# EAGLE design Senior Design Debug PCB V1 (EAGLE 6.5.0)
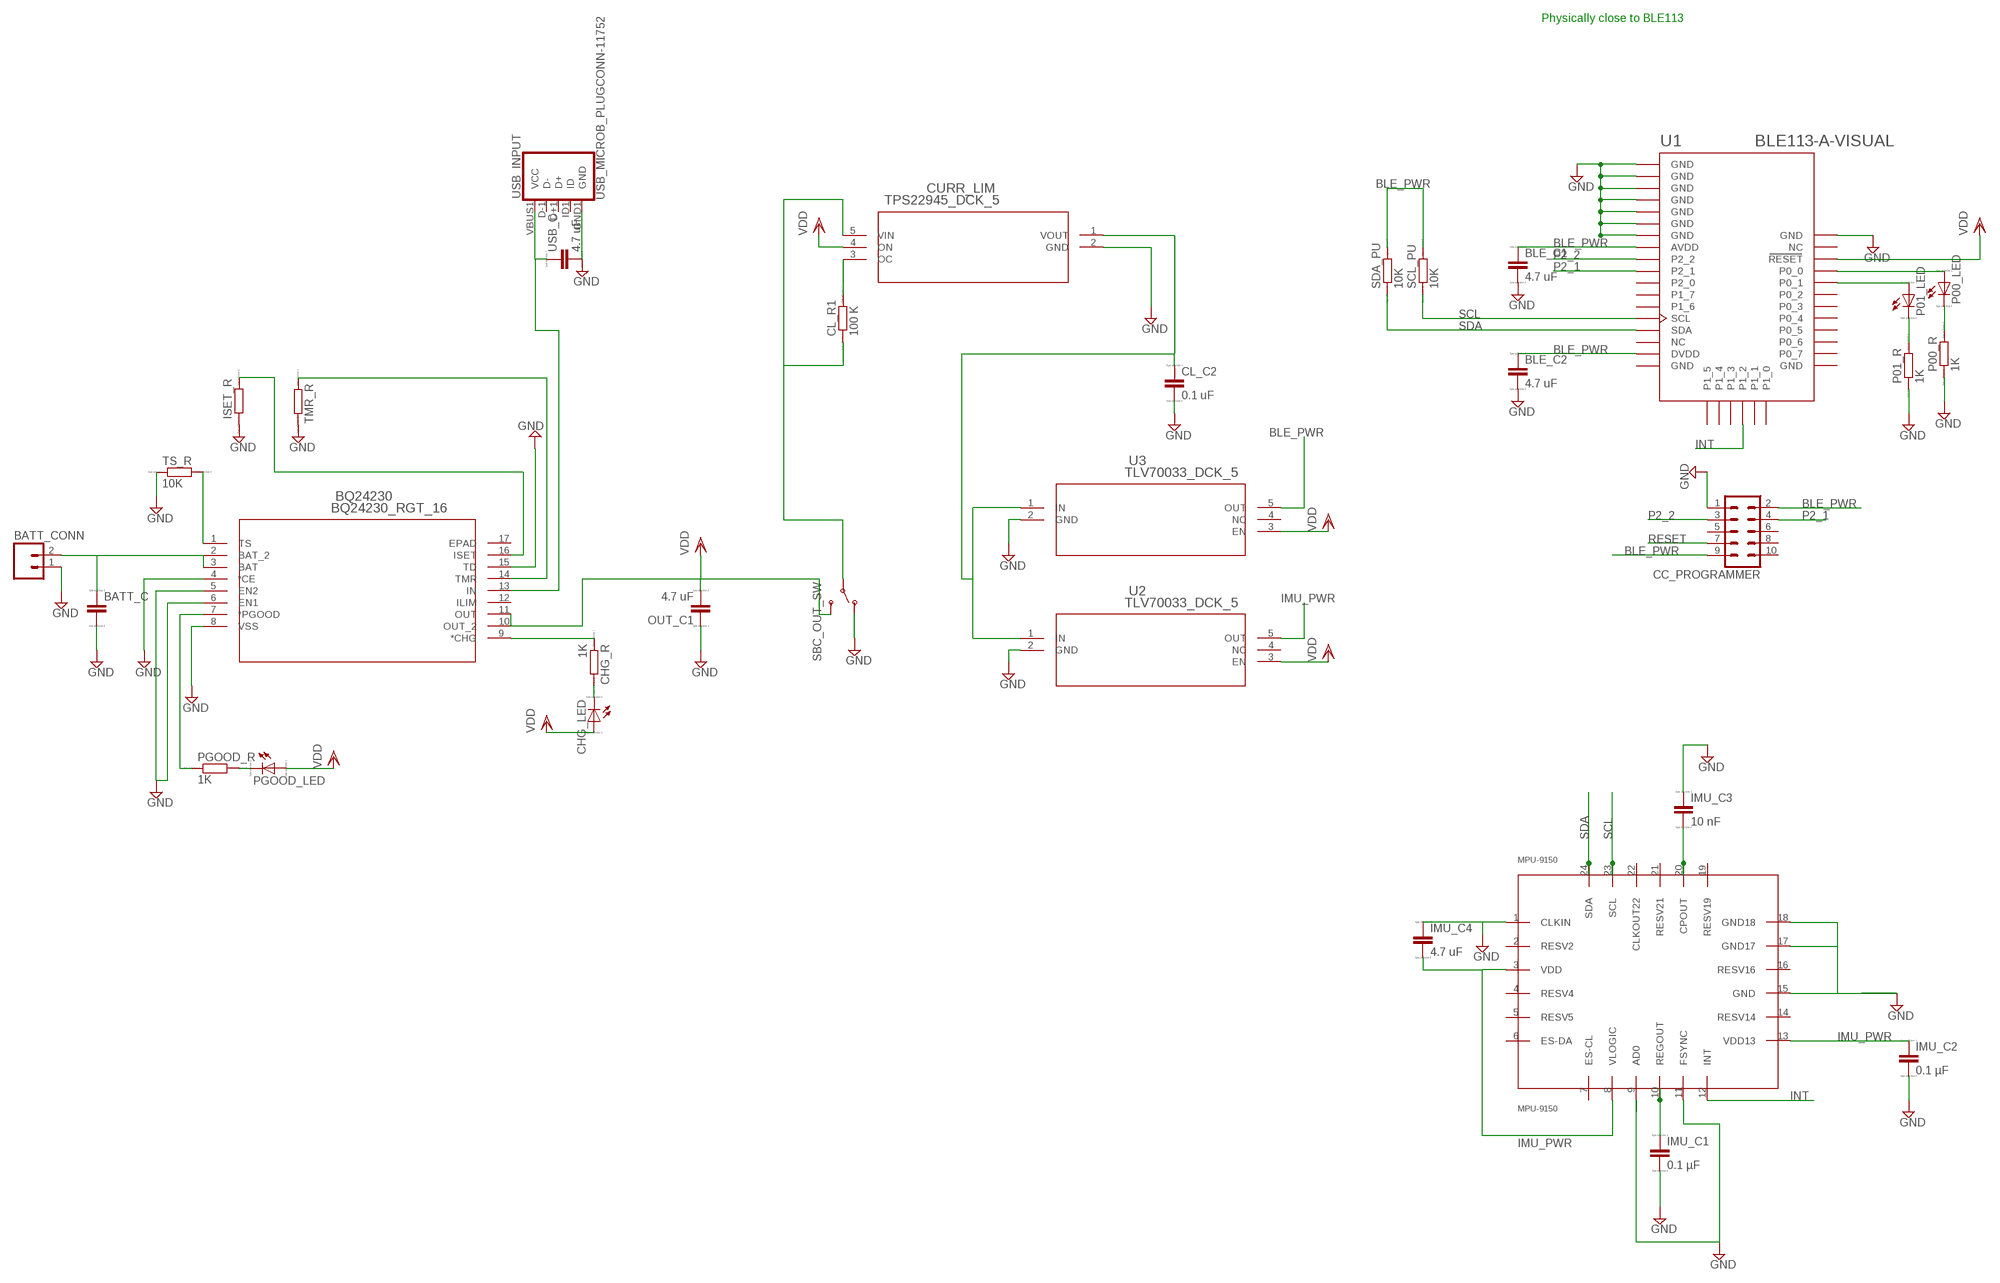
[diagram p0: schematic, sheet 1]

## Parts
BATT_C  C  [C0805]
BATT_CONN  M02  [02P]
BLE_C1  4.7 uF  C  [C0805]
BLE_C2  4.7 uF  C  [C0805]
BQ24230  BQ24230_RGT_16  [RGT16_1P7X1P7]
CC_PROGRAMMER  MA05-2  [MA05-2]
CHG_LED  LED_E  [LED_1206]
CHG_R  1K  R  [R0805]
CL_C2  0.1 uF  C  [C0805]
CL_R1  100 K  R  [R0805]
CURR_LIM  TPS22945_DCK_5  [DCK5]
IMU_C1  0.1 µF  C  [C0805]
IMU_C2  0.1 µF  C  [C0805]
IMU_C3  10 nF  C  [C0805]
IMU_C4  4.7 uF  C  [C0805]
ISET_R  R  [R0805]
MPU-9150  MPU-9150  [MPU-9150]
OUT_C1  4.7 uF  C  [C0805]
P00_LED  LED_E  [LED_1206]
P00_R  1K  R  [R0805]
P01_LED  LED_E  [LED_1206]
P01_R  1K  R  [R0805]
PGOOD_LED  LED_E  [LED_1206]
PGOOD_R  1K  R  [R0805]
SBC_OUT_SW  SWITCH-SPDTPTH  [SWITCH-SPDT]
SCL_PU  10K  R  [R0805]
SDA_PU  10K  R  [R0805]
TMR_R  R  [R0805]
TS_R  10K  R  [R0805]
U1  BLE113-A-VISUAL  [BLE113-A]
U2  TLV70033_DCK_5  [DCK5]
U3  TLV70033_DCK_5  [DCK5]
USB_C  4.7 uF  C  [C0805]
USB_INPUT  USB_MICROB_PLUGCONN-11752  [USB-B-MICRO-SMD_V03]

## Nets
BLE_PWR: BLE_C1.1 BLE_C2.1 CC_PROGRAMMER.2 CC_PROGRAMMER.9 SCL_PU.2 SDA_PU.2 U1.AVDD U1.DVDD U3.5(OUT)
DC_IN: BQ24230.13(IN) USB_C.1 USB_INPUT.VBUS1(VCC)
GND: BATT_C.2 BATT_CONN.1 BLE_C1.2 BLE_C2.2 BQ24230.4(*CE) BQ24230.5(EN2) BQ24230.6(EN1) BQ24230.8(VSS) BQ24230.15(TD) CC_PROGRAMMER.1 CL_C2.2 CURR_LIM.2(GND) IMU_C1.2 IMU_C2.2 IMU_C3.1 IMU_C4.1 ISET_R.1 MPU-9150.1(CLKIN) MPU-9150.9(AD0) MPU-9150.11(FSYNC) MPU-9150.15(GND) MPU-9150.17(GND17) MPU-9150.18(GND18) OUT_C1.1 P00_R.1 P01_R.1 SBC_OUT_SW.1(O) TMR_R.2 TS_R.1 U1.GND U1.GND@2(GND) U1.GND@3(GND) U1.GND@4(GND) U1.GND@5(GND) U1.GND@6(GND) U1.GND@7(GND) U1.GND@10(GND) U2.2(GND) U3.2(GND) USB_C.2 USB_INPUT.GND1(GND)
IMU_PWR: IMU_C2.1 IMU_C4.2 MPU-9150.3(VDD) MPU-9150.8(VLOGIC) MPU-9150.13(VDD13) U2.5(OUT)
INT: MPU-9150.12(INT) U1.P1_2
N$1: IMU_C3.2 MPU-9150.20(CPOUT)
N$2: BQ24230.16(ISET) ISET_R.2
N$3: IMU_C1.1 MPU-9150.10(REGOUT)
N$4: CHG_LED.C CHG_R.2
N$5: BQ24230.9(*CHG) CHG_R.1
N$6: PGOOD_LED.C PGOOD_R.2
N$7: P00_LED.A U1.P0_0
N$8: CL_C2.1 CURR_LIM.1(VOUT) U2.1(IN) U3.1(IN)
N$9: P01_LED.A U1.P0_1
N$13: P01_LED.C P01_R.2
N$14: P00_LED.C P00_R.2
N$15: CL_R1.2 CURR_LIM.3(OC)
N$17: BQ24230.1(TS) TS_R.2
N$19: BATT_C.1 BATT_CONN.2 BQ24230.2(BAT_2) BQ24230.3(BAT)
N$22: BQ24230.7(*PGOOD) PGOOD_R.1
N$29: CL_R1.1 CURR_LIM.5(VIN) SBC_OUT_SW.2(P)
N$31: BQ24230.14(TMR) TMR_R.1
P2_1: CC_PROGRAMMER.4 U1.P2_1
P2_2: CC_PROGRAMMER.3 U1.P2_2
RESET: CC_PROGRAMMER.7
SCL: MPU-9150.23(SCL) SCL_PU.1 U1.SCL
SDA: MPU-9150.24(SDA) SDA_PU.1 U1.SDA
VDD: BQ24230.10(OUT_2) BQ24230.11(OUT) CHG_LED.A CURR_LIM.4(ON) OUT_C1.2 PGOOD_LED.A SBC_OUT_SW.3(S) U1.RESET U2.3(EN) U3.3(EN)
Unconnected: BQ24230.12(ILIM) CC_PROGRAMMER.5 CC_PROGRAMMER.6 CC_PROGRAMMER.8 CC_PROGRAMMER.10 MPU-9150.2(RESV2) MPU-9150.4(RESV4) MPU-9150.5(RESV5) MPU-9150.6(ES-DA) MPU-9150.7(ES-CL) MPU-9150.14(RESV14) MPU-9150.16(RESV16) MPU-9150.19(RESV19) MPU-9150.21(RESV21) MPU-9150.22(CLKOUT22) U1.NC U1.NC@2(NC) U1.P0_2 U1.P0_3 U1.P0_4 U1.P0_5 U1.P0_6 U1.P0_7 U1.P1_0 U1.P1_1 U1.P1_3 U1.P1_4 U1.P1_5 U1.P1_6 U1.P1_7 U1.P2_0 U2.4(NC) U3.4(NC) USB_INPUT.D+1(D+) USB_INPUT.D-1(D-) USB_INPUT.ID1(ID)

## Notes on the sheet
- Physically close to BLE113

## Power pins joined to a net without a drawn wire
EPAD: BQ24230.17(EPAD)
GND: U1.GND@8(GND) U1.GND@9(GND)

## Library data of the parts
BATT_C BLE_C1 BLE_C2 CL_C2 IMU_C1-IMU_C4 OUT_C1 USB_C = eagle-ltspice:C: CAPACITOR, European symbol; SPICEMODEL: NONE; SPICEPREFIX: C
BATT_CONN = con-amp-quick:M02: AMP QUICK CONNECTOR; OC_FARNELL: unknown; OC_NEWARK: unknown
BQ24230 = BQ24230:BQ24230_RGT_16; DATASHEETURL: http://www.ti.com/lit/gpn/BQ24230; DESCRIPTION: USB Friendly 0.5A Li+ Charger w/ Dynamic Power Management, 6.6V OVP; FAMILY_NAME: BATTERY CHARGE MANAGEMENT; GENERIC_PART_NUMBER: BQ24230; INDUSTRY_STD_PKG_TYPE: QFN; MANUFACTURER: Texas Instruments; PACKAGE_DESIGNATOR: RGT; PIN_COUNT: 16
CC_PROGRAMMER = con-lstb:MA05-2: PIN HEADER; OC_FARNELL: unknown; OC_NEWARK: unknown
CHG_LED P00_LED P01_LED PGOOD_LED = eagle-ltspice:LED_E: LED Source: http://www.osram.convergy.de Source: www.luxeon.com Source: www.kingbright.com; SPICEMODEL: NONE; SPICEPREFIX: D; SPICETYPE: diode
CHG_R CL_R1 ISET_R P00_R P01_R PGOOD_R SCL_PU SDA_PU TMR_R TS_R = eagle-ltspice:R: RESISTOR, European symbol; SPICEMODEL: NONE; SPICEPREFIX: R
CURR_LIM = TPS22945:TPS22945_DCK_5; DATASHEETURL: http://www.ti.com/lit/gpn/TPS22945; DESCRIPTION: Low-Input Voltage Current Limited Load Switch with Shut-Off and Auto-Restart Features; FAMILY_NAME: CURRENT LIMITED SWITCH; GENERIC_PART_NUMBER: TPS22945; INDUSTRY_STD_PKG_TYPE: SC70; MANUFACTURER: Texas Instruments; MANUFACTURER_PART_NUMBER: tps22945_dck_5; PACKAGE_DESIGNATOR: DCK; PIN_COUNT: 5; VENDOR: Texas Instruments
MPU-9150 = mpu9150:MPU-9150
SBC_OUT_SW = SparkFun-Electromechanical:SWITCH-SPDT: SPDT Switch Simple slide switch, Spark Fun Electronics SKU : COM-00102 DPDT SMT slide switch, AYZ0202, SWCH-08179
U1 = sf-bluegiga:BLE113-A-VISUAL: Bluetooth Low Energy single-mode module - Bluetooth 4.0, chip antenna (CC2541)
U2 U3 = TLV70033:TLV70033_DCK_5; DATASHEETURL: http://www.ti.com/lit/gpn/TLV70033; DESCRIPTION: 200mA, Low IQ, Low Dropout Regulator for Portables; FAMILY_NAME: SINGLE CHANNEL LDO; GENERIC_PART_NUMBER: TLV70033; INDUSTRY_STD_PKG_TYPE: SC70; MANUFACTURER: Texas Instruments; MANUFACTURER_PART_NUMBER: tlv70033_dck_5; PACKAGE_DESIGNATOR: DCK; PIN_COUNT: 5; VENDOR: Texas Instruments
USB_INPUT = SparkFun-Connectors:USB_MICROB_PLUG: USB Micro-B Plug Comes in a variety of packages. Check out Hirose's ZX-x0 line: http://www.hirose.co.jp/cataloge_hp/e24200011.pdf; PROD_ID: CONN-11752

## Board
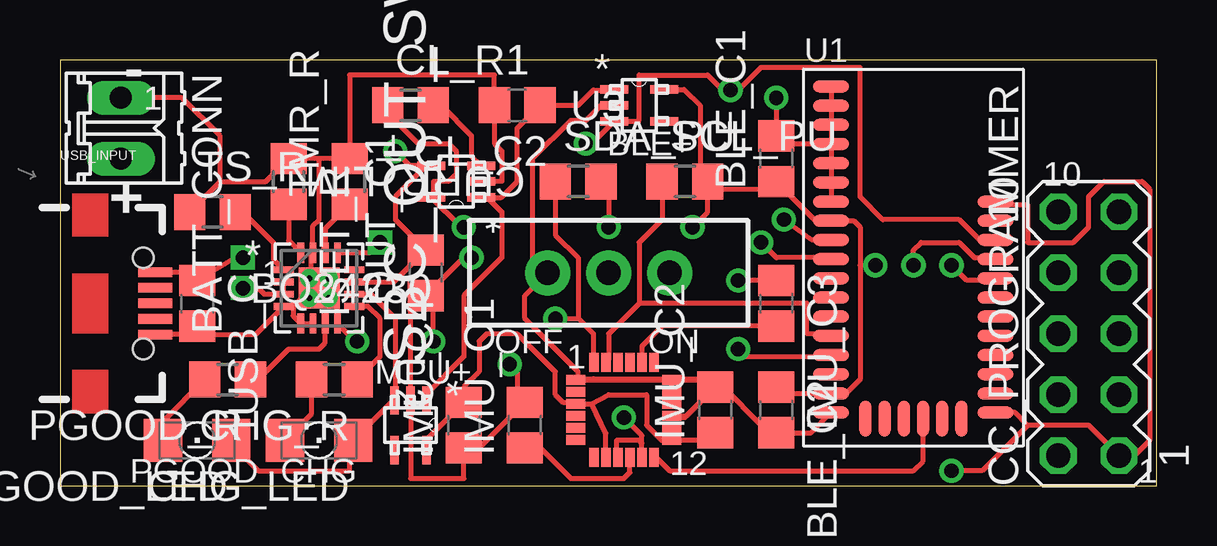
[diagram p1: board, top side]
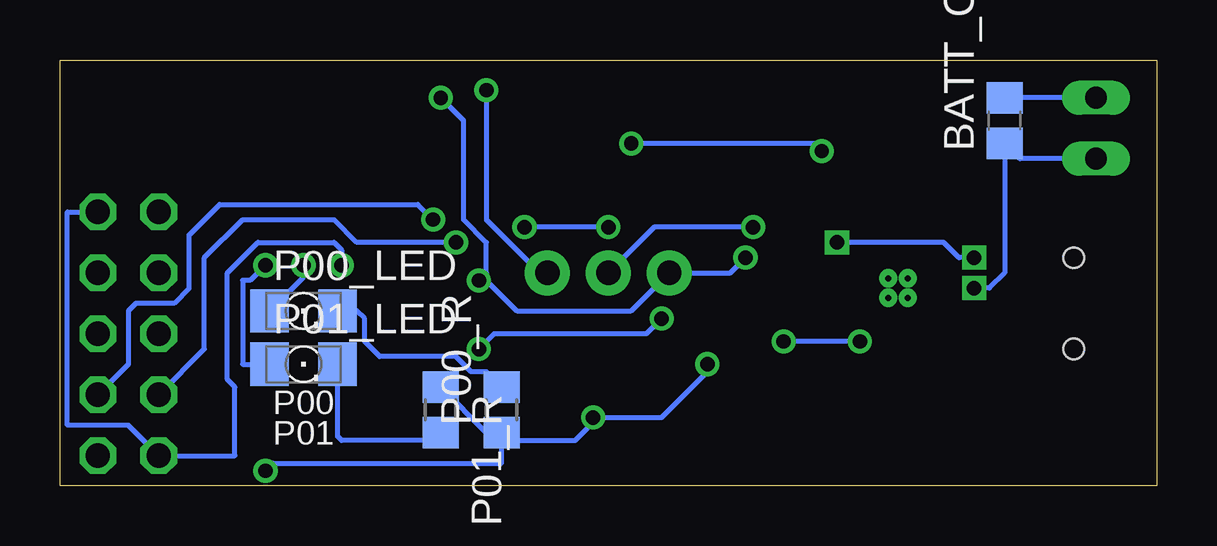
[diagram p2: board, bottom side, seen from below]

Size 45.71 x 17.77 mm. Coordinates in mm from the lower left corner, seen from the top.
Outline: 0,0 45.71,0 45.71,17.77 0,17.77 0,0
Copper layers (1*16): Top 0.035mm / dielectric 1.5mm / Bottom 0.035mm
Design rules "default *": minimum track width 8mil, minimum drill 24mil, track to track 8mil, track to pad 8mil, pad to pad 8mil, via to via 8mil, smd to smd 8mil, copper to edge 40mil, drill to drill 8mil, minimum pad ring 10mil, minimum via ring 8mil, stop-mask expansion 4mil, vias tented up to drill 0mil, thermal gap 10mil

### Footprints (pad centres in the part's own frame; a part is rotated, then mirrored left to right if it is on the bottom)
C0805 = smd 1.3 x 1.5: 1 -0.95,0; 2 0.95,0
02P = drill 0.914 long: 1 -1.27,0; 2 1.27,0
RGT16_1P7X1P7 = smd 0.838 x 0.279: 1 -1.473,0.762; 2 -1.473,0.254; 3 -1.473,-0.254; 4 -1.473,-0.762; 9 1.473,-0.762; 10 1.473,-0.254; 11 1.473,0.254; 12 1.473,0.762 | smd 0.279 x 0.838: 5 -0.762,-1.473; 6 -0.254,-1.473; 7 0.254,-1.473; 8 0.762,-1.473; 13 0.762,1.473; 14 0.254,1.473; 15 -0.254,1.473; 16 -0.762,1.473 | smd 1.702 x 1.702: 17 0,0 | drill 0.254: V 0.406,0.406; V_2 -0.406,0.406; V_3 -0.406,-0.406; V_4 0.406,-0.406
MA05-2 = drill 1.016 octagon: 1 -5.08,-1.27; 2 -5.08,1.27; 3 -2.54,-1.27; 4 -2.54,1.27; 5 0,-1.27; 6 0,1.27; 7 2.54,-1.27; 8 2.54,1.27; 9 5.08,-1.27; 10 5.08,1.27
LED_1206 = smd 1.6 x 1.803: A -1.422,0; C 1.422,0
R0805 = smd 1.3 x 1.5: 1 -0.95,0; 2 0.95,0
DCK5 = smd 1.168 x 0.356: 1 -1.041,0.66; 2 -1.041,0; 3 -1.041,-0.66; 4 1.041,-0.66; 5 1.041,0.66
MPU-9150 = smd 0.8 x 0.4: 1 -2,1.25; 2 -2,0.75; 3 -2,0.25; 4 -2,-0.25; 5 -2,-0.75; 6 -2,-1.25; 13 2,-1.25; 14 2,-0.75; 15 2,-0.25; 16 2,0.25; 17 2,0.75; 18 2,1.25 | smd 0.4 x 0.8: 7 -1.25,-1.975; 8 -0.75,-1.975; 9 -0.25,-1.975; 10 0.25,-1.975; 11 0.75,-1.975; 12 1.25,-1.975; 19 1.25,1.975; 20 0.75,1.975; 21 0.25,1.975; 22 -0.25,1.975; 23 -0.75,1.975; 24 -1.25,1.975
SWITCH-SPDT = drill 1.016 pad 1.88: 1 0,2.54; 2 0,0; 3 0,-2.54
BLE113-A = smd 1.5 x 0.5: AVDD -3.425,1.538; DVDD -3.425,-5.662; GND -3.425,7.138; GND@2 -3.425,6.338; GND@3 -3.425,5.537; GND@4 -3.425,4.737; GND@5 -3.425,3.938; GND@6 -3.425,3.138; GND@7 -3.425,2.337; GND@8 -3.425,-6.463; GND@9 3.425,-6.463; GND@10 3.425,2.337; NC -3.425,-4.862; NC@2 3.425,1.538; P0_0 3.425,-0.062; P0_1 3.425,-0.863; P0_2 3.425,-1.663; P0_3 3.425,-2.462; P0_4 3.425,-3.263; P0_5 3.425,-4.062; P0_6 3.425,-4.862; P0_7 3.425,-5.662; P1_6 -3.425,-2.462; P1_7 -3.425,-1.663; P2_0 -3.425,-0.863; P2_1 -3.425,-0.062; P2_2 -3.425,0.738; RESET 3.425,0.738; SCL -3.425,-3.263; SDA -3.425,-4.062 | smd 0.5 x 1.5: P1_0 2,-6.713; P1_1 1.2,-6.713; P1_2 0.4,-6.713; P1_3 -0.4,-6.713; P1_4 -1.2,-6.713; P1_5 -2,-6.713
USB-B-MICRO-SMD_V03 = smd 1.4 x 0.4: D+1 2.7,0; D-1 2.7,0.65; GND1 2.7,-1.3; ID1 2.7,-0.65; VBUS1 2.7,1.3 | hole 0.85: 2.2,1.9; 2.2,-1.9

### Placement (x,y rotation side)
BATT_C  6.35,15.24 90 bottom
BATT_CONN  2.54,14.92 270 top
BLE_C1  29.84,13.65 90 top
BLE_C2  29.84,3.17 270 top
BQ24230  10.79,8.26 0 top
CC_PROGRAMMER  42.86,6.35 90 top
CHG_LED  10.79,1.91 180 top
CHG_R  11.43,4.45 180 top
CL_C2  19.05,15.88 180 top
CL_R1  14.61,15.88 0 top
CURR_LIM  16.51,12.7 180 top
IMU_C1  19.37,2.54 90 top
IMU_C2  27.3,3.17 90 top
IMU_C3  29.84,7.62 270 top
IMU_C4  16.83,2.54 90 top
ISET_R  9.53,12.7 270 top
MPU-9150  23.5,3.17 0 top
OUT_C1  15.24,8.89 90 top
P00_LED  35.56,7.3 0 bottom
P00_R  27.3,3.17 90 bottom
P01_LED  35.56,5.08 0 bottom
P01_R  29.84,3.17 270 bottom
PGOOD_LED  5.71,1.91 180 top
PGOOD_R  6.99,4.45 180 top
SBC_OUT_SW  22.86,8.89 90 top
SCL_PU  26.04,12.7 0 top
SDA_PU  21.59,12.7 0 top
TMR_R  12.06,12.7 90 top
TS_R  6.35,11.43 0 top
U1  35.56,9.53 0 top
U2  14.61,2.54 270 top
U3  24.13,15.88 0 top
USB_C  5.71,7.62 270 top
USB_INPUT  1.27,7.62 0 top

### Tracks (layer width: path | path; a pad name or v marks a point on that pad's centre or on a via)
BLE_PWR  (via drill 0.6)
  Top 0.203: U3.5 26.01,16.54 26.67,15.88 26.67,13.02 SCL_PU.2 | SDA_PU.2 22.86,12.38 v22.86,10.79 | SCL_PU.2 27.3,12.38 29.52,12.38 BLE_C1.1 31.43,11.11 32.09,11.11 U1.AVDD 33.07,11.06 33.34,10.79 33.34,9.21 | BLE_C2.1 30.11,3.86 U1.DVDD 32.19,3.81 32.7,3.81 33.34,4.45 33.34,9.21 | v33.97,9.21 33.34,9.21 | v26.35,10.79 26.98,11.43 SCL_PU.2
  Bottom 0.203: v22.86,10.79 v26.35,10.79 | v33.97,9.21 33.97,9.84 34.29,10.16 37.47,10.16 38.73,8.89 38.73,4.45 38.42,4.13 38.42,1.27 CC_PROGRAMMER.2 42.86,2.54 45.4,2.54 45.4,11.43 CC_PROGRAMMER.9
DC_IN  (via drill 0.6)
  Top 0.203: USB_INPUT.VBUS1 6,8.92 USB_C.1 7.3,9.53 v7.62,9.53 | v13.34,10.16 12.9,9.73 BQ24230.13
  Bottom 0.203: v13.34,10.16 8.89,10.16 8.26,9.53 v7.62,9.53
GND  (via drill 0.6)
  Top 0.203: USB_INPUT.GND1 3.84,6.32 3.81,6.35 5.39,6.35 USB_C.2 6,6.32 8.15,6.32 BQ24230.4 9.72,7.49 | 9.72,7.49 10.48,8.26 | 10.48,8.26 10.48,9.66 BQ24230.15 10.54,10.86 10.79,11.11 10.79,13.65 | 10.48,8.26 10.79,7.94 11.43,7.94 11.56,7.81 BQ24230.8 12.31,6.03 v12.38,6.03 | CL_C2.2 18.1,17.14 12.06,17.14 TMR_R.2 10.79,13.65 | MPU-9150.18 27,4.42 IMU_C2.2 | 9.72,7.49 9.72,7.1 BQ24230.5 BQ24230.6 | TS_R.1 6.67,12.7 | 6.67,12.7 8.57,12.7 ISET_R.1 10.79,13.65 | 6.67,12.7 6.67,14.61 5.08,16.19 BATT_CONN.1 | OUT_C1.1 14.61,7.3 U2.2 14.61,0.32 16.83,0.32 IMU_C4.1 17.47,1.59 IMU_C1.2 19.05,3.81 19.05,4.76 v18.73,5.08 | CL_C2.2 18.1,14.29 18.41,13.97 18.41,12.7 CURR_LIM.2 | IMU_C2.2 26.11,2.92 MPU-9150.15 25.43,2.86 26.04,2.86 IMU_C2.2 | MPU-9150.17 MPU-9150.18 | MPU-9150.1 MPU-9150.18 | MPU-9150.9 23.18,1.27 23.18,1.91 24.13,1.91 24.25,1.79 MPU-9150.11 24.25,2.11 v23.5,2.86 | IMU_C2.2 27.62,4.12 29.21,2.54 29.53,2.54 BLE_C2.2 31.3,2.23 U1.GND@8 | U1.GND U1.GND@2 U1.GND@3 U1.GND@4 | U1.GND@4 U1.GND@5 U1.GND@6 U1.GND@7 | U1.GND@4 30.18,14.26 BLE_C1.2 v29.84,16.19 | v15.56,6.03 15.56,7.62 OUT_C1.1 | v17.14,9.53 16.82,9.53 OUT_C1.1 | CL_C2.2 | U3.2 22.54,15.88 21.91,15.24 21.27,15.24 19.68,13.65 19.68,9.53 SBC_OUT_SW.1 19.37,7.94 19.37,6.99 21.59,4.76 21.59,4.45 26.67,4.45 26.99,4.13 IMU_C2.2 | IMU_C2.2 | 40.32,2.54 42.86,2.54 CC_PROGRAMMER.1 44.77,1.27 45.4,1.91 45.4,12.38 45.09,12.7 43.5,12.7 42.86,12.06 42.86,10.79 42.23,10.16 40.32,10.16 40.32,11.75 39.1,11.75 U1.GND@10 | U1.GND@9 39.8,3.06 40.32,2.54 | 40.32,2.54 38.42,0.64 v37.15,0.64 | IMU_C3.1 v28.26,8.57 IMU_C3.1
  Bottom 0.203: BATT_CONN.1 BATT_C.2 | v12.38,6.03 v15.56,6.03 | v17.14,9.53 17.78,8.89 SBC_OUT_SW.1 21.91,7.3 26.67,7.3 27.94,8.57 v28.26,8.57 27.94,8.89 27.94,10.16 28.89,11.11 28.89,15.24 v29.84,16.19 | v18.73,5.08 18.73,4.76 20.64,2.86 v23.5,2.86 23.5,2.65 24.25,1.91 26.98,1.91 P00_R.1 | P01_R.1 27.95,2.23 P00_R.1 | v37.15,0.64 36.83,0.95 27.3,0.95 P00_R.1
IMU_PWR
  Top 0.203: U2.5 15.27,1.93 IMU_C4.2 | IMU_C4.2 16.83,3.81 | IMU_C2.1 27,1.93 MPU-9150.13 25.48,1.91 25.08,1.91 24.45,2.54 24.45,3.81 22.86,3.81 22.16,3.42 | 22.16,3.42 MPU-9150.3 21.43,3.49 20.95,3.49 20.64,3.81 20.64,4.76 19.05,6.35 17.78,6.35 17.46,6.03 17.46,4.76 16.83,4.13 IMU_C4.2 | MPU-9150.8 22.75,2.2 22.16,3.42
INT
  Top 0.203: MPU-9150.12 24.84,1.2 25.4,0.64 35.56,0.64 35.96,1.03 U1.P1_2
N$1
  Top 0.203: IMU_C3.2 25.09,6.67 24.25,5.83 MPU-9150.20
N$2
  Top 0.203: ISET_R.2 9.53,10.24 BQ24230.16
N$3
  Top 0.203: IMU_C1.1 20,1.59 21.27,0.32 23.5,0.32 23.75,0.57 MPU-9150.10
N$4
  Top 0.203: CHG_LED.C 10.48,3.01 CHG_R.2
N$5
  Top 0.203: CHG_R.1 12.27,4.56 12.49,4.56 13.34,5.4 13.34,6.99 12.83,7.49 BQ24230.9
N$6
  Top 0.203: PGOOD_LED.C 4.29,2.7 PGOOD_R.2
N$7  (via drill 0.6)
  Top 0.203: v35.56,9.21 35.56,9.84 35.88,10.16 37.47,10.16 38.1,9.53 38.92,9.53 U1.P0_0
  Bottom 0.203: P00_LED.A 35.56,8.72 v35.56,9.21
N$8
  Top 0.203: U2.1 15.24,3.61 15.24,3.81 16.83,5.4 16.83,7.94 18.41,9.53 18.41,11.43 17.8,12.04 CURR_LIM.1 18.39,12.04 19.05,12.7 19.05,14.93 CL_C2.1 21.59,15.88 22.23,16.51 23.06,16.51 U3.1
N$9  (via drill 0.6)
  Top 0.203: U1.P0_1 38.9,8.57 37.78,8.57 v37.15,9.21
  Bottom 0.203: v37.15,9.21 37.78,8.57 38.1,8.57 38.1,5.08 P01_LED.A
N$13
  Bottom 0.203: P01_R.2 30.16,1.91 33.97,1.91 34.14,2.07 P01_LED.C
N$14
  Bottom 0.203: P00_R.2 27.94,4.76 28.57,4.76 29.21,5.4 32.38,5.4 33.02,6.03 33.02,6.99 33.34,7.3 P00_LED.C
N$15
  Top 0.203: CL_R1.2 15.88,15.88 17.14,14.61 17.14,13.77 CURR_LIM.3
N$17
  Top 0.203: TS_R.2 7.62,11.43 8.89,10.16 8.89,9.45 BQ24230.1
N$19  (via drill 0.6)
  Top 0.203: BQ24230.2 BQ24230.3 8.51,8 8.26,8.26 v7.62,8.26
  Bottom 0.203: v7.62,8.26 6.99,8.26 6.35,8.89 BATT_C.1 5.71,13.65 BATT_CONN.2
  Bottom 0.406: 6.35,13.97 BATT_C.1
N$22
  Top 0.203: PGOOD_R.1 8.26,4.45 9.53,5.71 10.79,5.71 11.05,5.97 BQ24230.7
N$29  (via drill 0.6)
  Top 0.203: CL_R1.1 13.65,15.55 14.92,14.29 16.19,14.29 16.51,13.97 16.51,13.02 16.19,12.7 15.56,12.7 15.56,12.13 CURR_LIM.5 16.71,10.79 v16.83,10.79
  Bottom 0.203: v16.83,10.79 20.95,10.79 SBC_OUT_SW.2
N$31
  Top 0.203: TMR_R.1 11.05,10.73 BQ24230.14
P2_1  (via drill 0.6)
  Top 0.203: U1.P2_1 32.07,9.53 | 32.07,9.53 32.38,9.53 | 32.07,9.53 29.84,9.53 v29.21,10.16
  Bottom 0.203: v29.21,10.16 33.34,10.16 34.29,11.11 38.1,11.11 39.69,9.53 39.69,5.71 CC_PROGRAMMER.4
P2_2  (via drill 0.6)
  Top 0.203: U1.P2_2 31.33,10.26 v30.16,11.11
  Bottom 0.203: v30.16,11.11 30.8,11.75 39.05,11.75 40.32,10.48 40.32,8.26 40.96,7.62 42.55,7.62 42.86,7.3 42.86,5.08 CC_PROGRAMMER.3
SCL
  Top 0.203: SCL_PU.1 25.09,11.12 24.13,10.16 24.13,7.62 | 24.13,7.62 22.86,6.35 22.86,5.26 MPU-9150.23 | U1.SCL 32.05,6.35 31.11,6.35 31.11,7.62 24.13,7.62
SDA  (via drill 0.6)
  Top 0.203: SDA_PU.1 20.64,10.47 21.59,9.53 21.59,6.99 | 21.59,6.99 22.23,6.35 22.23,5.17 MPU-9150.24 | v20.64,6.99 21.59,6.99 | v28.26,5.71 28.57,5.4 32.07,5.4 U1.SDA
  Bottom 0.203: 27.94,6.03 v28.26,5.71 27.62,6.35 21.27,6.35 v20.64,6.99
VDD  (via drill 0.6)
  Top 0.203: PGOOD_LED.A 7.14,1.75 8.26,0.64 12.06,0.64 12.06,1.75 CHG_LED.A 13.89,3.58 U2.3 13.97,3.61 13.97,6.99 12.95,8 BQ24230.10 BQ24230.11 13.91,8.51 OUT_C1.2 13.97,11.11 13.97,12.06 15.27,13.36 CURR_LIM.4 14.58,13.36 v13.97,13.97 | U1.RESET 38.31,10.26 37.47,11.11 34.29,11.11 33.34,12.06 33.34,17.46 29.21,17.46 28.26,16.51 v27.94,16.51 27.62,16.51 26.99,17.14 24.13,17.14 24.13,15.24 24.11,15.21 U3.3 22.16,14.29 v21.91,14.29
  Bottom 0.203: v27.94,16.51 27.94,11.11 25.72,8.89 SBC_OUT_SW.3 | v13.97,13.97 14.29,14.29 v21.91,14.29

### Text on the board
tPlace: - | BLE+ | 10 | + | 1 | OFF | ON | MPU+ | 1 | PGOOD | CHG | 12 | 1
bPlace: P00 | P01